# EAGLE schematic lm3405-12v (EAGLE 6.4)
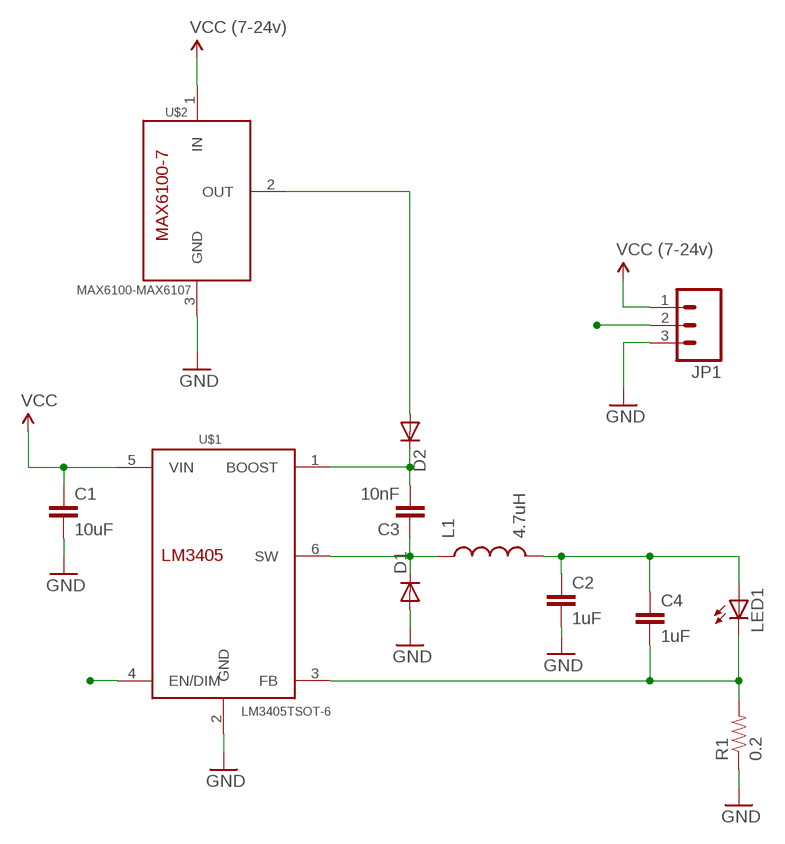
[diagram p0: schematic, sheet 1]

## Parts
C1  10uF  CAP0805  [0805]
C2  1uF  CAP1206  [1206]
C3  10nF  CAP0805  [0805]
C4  1uF  CAP1206  [1206]
D1  DIODESMA  [SMA-DIODE]
D2  DIODESOD  [SOD-323]
JP1  M03PTH  [1X03]
L1  4.7uH  INDUCTOR1210  [1210]
LED1  LED3MM  [LED3MM]
R1  0.2  RESISTOR2010  [R2010]
U$1  LM3405TSOT-6  [TSOT-6]
U$2  MAX6100-MAX6107  [SOT-23-3]

## Nets
GND: C1.2 C2.2 D1.A JP1.3 R1.1 U$1.2(GND) U$2.3(GND)
N$1: C3.1 D1.C L1.1 U$1.6(SW)
N$2: C4.2 LED1.K(C) R1.2 U$1.3(FB)
N$3: C3.2 D2.1(C) U$1.1(BOOST)
N$4: C2.1 C4.1 L1.2 LED1.A
N$6: D2.2(A) U$2.2(OUT)
PWM: JP1.2 U$1.4(EN/DIM)
VCC: C1.1 JP1.1 U$1.5(VIN) U$2.1(IN) ; supply symbol labelled VCC (7-24v)

## Library data of the parts
C1-C4 = SparkFun-Capacitors:CAP: Capacitor Standard 0603 ceramic capacitor, and 0.1" leaded capacitor.
D1 D2 = SparkFun-DiscreteSemi:DIODE: Diode These are standard reverse protection diodes and small signal diodes. SMA package can handle up to about 1A. SOD-323 can handle about 200mA. What the SOD-323 package when ordering, there are some mfgs out there that are 5-pin packages.
JP1 = SparkFun-Connectors:M03: Header 3 Standard 3-pin 0.1" header. Use with straight break away headers (SKU : PRT-00116), right angle break away headers (PRT-00553), swiss pins (PRT-00743), machine pins (PRT-00117), and female headers (PRT-00115). Molex polarized connector foot print use with SKU : PRT-08232 with associated crimp pins and housings.
L1 = SparkFun-Passives:INDUCTOR: Inductors Basic Inductor/Choke - 0603 and 1206. Footprints are not proven and vary greatly between part numbers.
LED1 = SparkFun-LED:LED: LEDs Standard schematic elements and footprints for 5mm, 3mm, 1206, and 0603 sized LEDs. 5mm - Spark Fun Electronics SKU : COM-00529 (and others)
R1 = SparkFun-Resistors:RESISTOR: Resistor Basic schematic elements and footprints for 0603, 1206, and PTH resistors.
U$1 = Synapseware:LM3405: LM3405 1.6MHz, 1A Constant Current Buck Regulator for Powering LEDs
U$2 = Synapseware:MAX6100-MAX6107: The MAX6100–MAX6107 are low-cost, low-dropout (LDO), micropower voltage references. These three-terminal references are available with output voltage options of 1.25V, 1.8V, 2.048V, 2.5V, 3V, 4.096V, 4.5V, and 5V.